# Altium schematic sheet Sheet1.SchDoc
size A; SheetNumber: 1; SheetTotal: 1
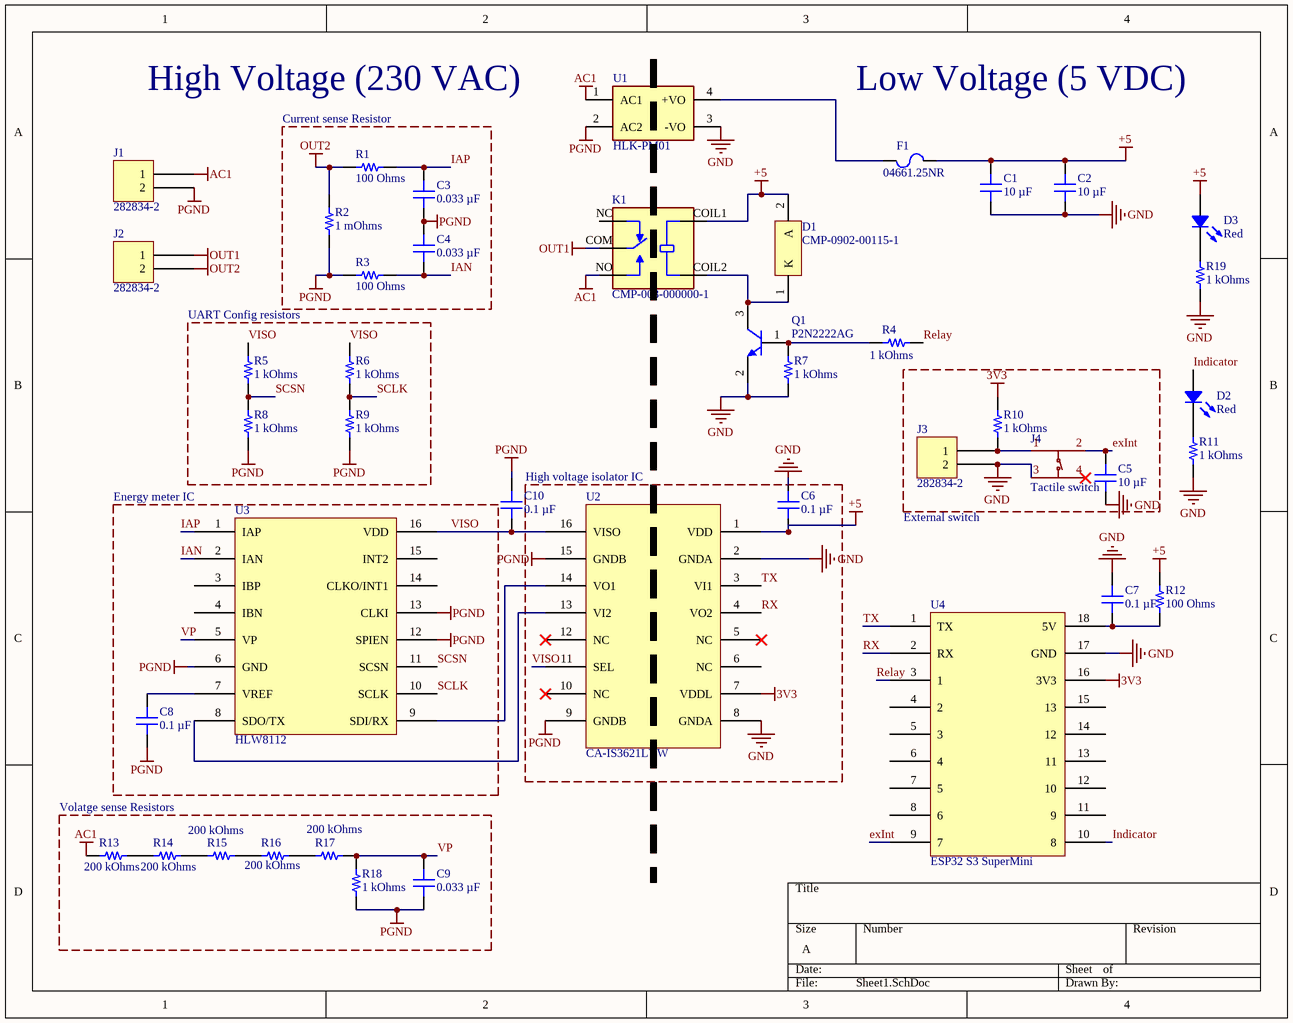
[diagram p0: Sheet1.SchDoc]

## Parts
C1  10 µF  [CAP 0805_2012]
C2  10 µF  [CAP 0805_2012]
C3  0.033 µF  [CAP 0805_2012]
C4  0.033 µF  [CAP 0805_2012]
C5  10 µF  [CAP 0805_2012]
C6  0.1 µF  [CAP 0805_2012]
C7  0.1 µF  [CAP 0805_2012]
C8  0.1 µF  [CAP 0805_2012]
C9  0.033 µF  [CAP 0805_2012]
C10  0.1 µF  [CAP 0805_2012]
D1  CMP-0902-00115-1  [CMP-0902-00115-1]
D2  Red  [LED 0805_2012 RED]
D3  Red  [LED 0805_2012 RED]
F1  04661.25NR  [FUSE 1206_3216 0.6MM]
J1  282834-2  [TE 282834-2]
J2  282834-2  [TE 282834-2]
J3  282834-2  [TE 282834-2]
J4  Tactile switch  [Tactive switch]
K1  CMP-003-000000-1  [CMP-003-000000-1]
Q1  P2N2222AG  [FP-SOT23-IPC_A]
R1  100 Ohms  [YAGEO RES 0805_2012]
R2  1 mOhms  [RES 1206_3216]
R3  100 Ohms  [YAGEO RES 0805_2012]
R4  1 kOhms  [RES 0805_2012]
R5  1 kOhms  [RES 0805_2012]
R6  1 kOhms  [RES 0805_2012]
R7  1 kOhms  [RES 0805_2012]
R8  1 kOhms  [RES 0805_2012]
R9  1 kOhms  [RES 0805_2012]
R10  1 kOhms  [RES 0805_2012]
R11  1 kOhms  [RES 0805_2012]
R12  100 Ohms  [YAGEO RES 0805_2012]
R13  200 kOhms  [RES 2512_6432]
R14  200 kOhms  [RES 2512_6432]
R15  200 kOhms  [RES 2512_6432]
R16  200 kOhms  [RES 2512_6432]
R17  200 kOhms  [RES 2512_6432]
R18  1 kOhms  [RES 0805_2012]
R19  1 kOhms  [RES 0805_2012]
U1  HLK-PM01  [HLK-PM01]
U2  CA-IS3621LVW  [CA-IS3621LVW]
U3  HLW8112  [HLW8112]
U4  ESP32 S3 SuperMini  [ESP32 S3 SuperMini]

## Blocks framed on the sheet
Current sense Resistor: C3 C4 R1-R3
UART Config resistors: R5 R6 R8 R9
Energy meter IC: C8 U3
High voltage isolator IC: C6 U2
Volatge sense Resistors: C9 R13-R18

## Nets
3V3: R10.1 U2.7(VDDL) U4.16(3V3)
+5: C1.1 C2.1 C6.1 D1.2(A) D3.1 F1.2 K1.COIL1 R12.2 U2.1(VDD)
AC1: J1.1 K1.NO R13.1 U1.1(AC1)
GND: C1.2 C2.2 C5.2 C6.2 C7.2 J3.2 J4.3(C) Q1.2(E) R7.1 R11.2 R19.2 U1.3(-VO) U2.2(GNDA) U2.8(GNDA) U4.17(GND)
OUT1: J2.1 K1.COM
OUT2: J2.2 R1.1 R2.2
PGND: C3.1 C4.2 C8.1 C9.1 C10.2 J1.2 R2.1 R3.1 R8.1 R9.1 R18.1 U1.2(AC2) U2.9(GNDB) U2.15(GNDB) U3.6(GND) U3.12(SPIEN) U3.13(CLKI)
exInt: C5.1 J4.2(B) U4.9(7)
IAN: C4.1 R3.2 U3.2(IAN)
IAP: C3.2 R1.2 U3.1(IAP)
Indicator: D2.1 U4.10(8)
Relay: R4.2 U4.3(1)
RX: U2.4(VO2) U4.2(RX)
SCLK: R6.1 R9.2 U3.10(SCLK)
SCSN: R5.1 R8.2 U3.11(SCSN)
TX: U2.3(VI1) U4.1(TX)
VISO: C10.1 R5.2 R6.2 U2.11(SEL) U2.16(VISO) U3.16(VDD)
VP: C9.2 R17.2 R18.2 U3.5(VP)
NetC7_1: C7.1 R12.1 U4.18(5V)
NetC8_2: C8.2 U3.7(VREF)
NetD1_1: D1.1(K) K1.COIL2 Q1.3(C)
NetD2_2: D2.2 R11.1
NetD3_2: D3.2 R19.1
NetF1_1: F1.1 U1.4(+VO)
NetJ3_1: J3.1 J4.1(A) R10.2
NetQ1_1: Q1.1(B) R4.1 R7.2
NetR13_2: R13.2 R14.1
NetR14_2: R14.2 R15.1
NetR15_2: R15.2 R16.1
NetR16_2: R16.2 R17.1
NetU2_13: U2.13(VI2) U3.8(SDO/TX)
NetU2_14: U2.14(VO1) U3.9(SDI/RX)

Not connected (* = marked no-connect by the designer): J4 4(D)*; K1 NC; U2 5(NC)* 6(NC) 10(NC)* 12(NC)*; U3 3(IBP) 4(IBN) 14(CLKO/INT1) 15(INT2); U4 4(2) 5(3) 6(4) 7(5) 8(6) 11(9) 12(10) 13(11) 14(12) 15(13)

## Notes on the sheet
- High Voltage (230 VAC)
- Low Voltage (5 VDC)
- External switch

## Library data of the parts
C1 C2 C5 = CL21Y106KPQVPNE: CAP CER 10UF 10V X7S 0805; manufacturer: Samsung Electro-Mechanics; Tolerance: ±10%; Part Number: CL21Y106KPQVPNE; Capacitance: 10 µF; Applications: Automotive; componentlink1description: Datasheet; componentlink1url: http://www.samsungsem.com/kr/support/product-search/mlcc/CL21Y106KPQVPNE.jsp; componentlink2description: DigiKey Link; componentlink2url: https://www.digikey.com/en/products/detail/samsung-electro-mechanics/CL21Y106KPQVPNE/5961169; Device Package: 0805 (2012 Metric); Features: General Purpose; lastupdated: 2026-04-06 7:33:17 PM; Lifecycle Status: Active; Minimum Order: 1; Mounting Type: Surface Mount, MLCC, Epoxy; Operating Temperature: -55°C ~ 125°C; Package / Case: 0805 (2012 Metric); packaging: TapeAndReel; partid: 2979; Part Status: Active; price: 0.06; Ratings: AEC-Q200; series: CL; Size / Dimension: 0.079" L x 0.049" W (2.00mm x 1.25mm); Supplier 1: DigiKey; Supplier Part Number 1: 1276-6685-1-ND; Temperature Coefficient: X7S; Thickness (Max): 0.055" (1.40mm); value: 10 µF; Voltage - Rated: 10V
C3 C4 C9 = C0805C333K5RECAUTO: CAP CER 0805 33NF 50V X7R 10%; manufacturer: KEMET; Part Number: C0805C333K5RECAUTO; Capacitance: 0.033 µF; Applications: Automotive, ESD Protection; componentlink1description: Datasheet; componentlink1url: https://api.kemet.com/component-edge/download/datasheet/C0805C333K5RECAUTO.pdf; componentlink2description: DigiKey Link; componentlink2url: https://www.digikey.com/en/products/detail/kemet/C0805C333K5RECAUTO/8646705; Device Package: 0805 (2012 Metric); lastupdated: 2026-04-06 7:32:00 PM; Lifecycle Status: Active; Minimum Order: 1; Mounting Type: Surface Mount, MLCC; Operating Temperature: -55°C ~ 125°C; Package / Case: 0805 (2012 Metric); packaging: TapeAndReel; partid: 32339; Part Status: Active; price: 0.04; Ratings: AEC-Q200; series: ESD SMD Auto X7R; Size / Dimension: 0.079" L x 0.049" W (2.00mm x 1.25mm); Supplier 1: DigiKey; Supplier Part Number 1: 399-C0805C333K5RECAUTOCT-ND; Temperature Coefficient: X7R; Thickness (Max): 0.043" (1.10mm); Tolerance: ±10%; value: 0.033 µF; Voltage - Rated: 50V
C6-C8 C10 = CC0805MRX7R9BB104: CAP CER 0.1UF 50V X7R 0805; manufacturer: Yageo; Tolerance: ±20%; Part Number: CC0805MRX7R9BB104; Capacitance: 0.1 µF; Applications: General Purpose; componentlink1description: Datasheet; componentlink1url: https://www.yageo.com/upload/media/product/productsearch/datasheet/mlcc/UPY-GPHC_X7R_6.3V-to-50V_18.pdf; componentlink2description: DigiKey Link; componentlink2url: https://www.digikey.com/en/products/detail/yageo/CC0805MRX7R9BB104/5884281; Device Package: 0805 (2012 Metric); lastupdated: 2026-04-06 7:33:19 PM; Lifecycle Status: Active; Minimum Order: 1; Mounting Type: Surface Mount, MLCC; Operating Temperature: -55°C ~ 125°C; Package / Case: 0805 (2012 Metric); packaging: TapeAndReel; partid: 2475; Part Status: Active; price: 0.01; series: CC; Size / Dimension: 0.079" L x 0.049" W (2.00mm x 1.25mm); Supplier 1: DigiKey; Supplier Part Number 1: 311-4351-1-ND; Temperature Coefficient: X7R; Thickness (Max): 0.037" (0.95mm); value: 0.1 µF; Voltage - Rated: 50V
D2 D3 = 5990110007F: LED RED 0805 SMD; Manufacturer: Dialight; Configuration: Standard; Current - Test: 20mA; Lens Color: 0.80mm; Lens Size: 1.40mm x 1.25mm; Lens Style: Rectangle with Flat Top; Millicandela Rating: 29mcd; Viewing Angle: 140°; Voltage - Forward (Vf) (Typ): 2.1V; Wavelength - Dominant: 633nm; Part Number: 5990110007F; Color: Red; ComponentLink1Description: Datasheet; ComponentLink1URL: http://www.dialightsignalsandcomponents.com/Assets/Brochures_And_Catalogs/Indication/CBI_SMD_new/Dialight_CBI_data_599-0805_Apr2018.pdf; ComponentLink2Description: DigiKey Link; ComponentLink2URL: https://www.digikey.com/en/products/detail/dialight/5990110007F/9385408; Device Package: 0805 (2012 Metric); Height (Max): 0.80mm; LastUpdated: 2026-04-05 8:38:27 PM; Lifecycle Status: Active; Minimum Order: 1; Mounting Type: Surface Mount; Package / Case: 0805 (2012 Metric); Packaging: TapeAndReel; PartId: 308; Part Status: Active; Price: 0.04; Series: 599; Size / Dimension: 2.00mm L x 1.25mm W; Supplier 1: DigiKey; Supplier Part Number 1: 350-4353-1-ND; Supplier Device Package: 0805; Value: Red
F1 = 04661.25NR: FUSE BOARD MOUNT 1.25A 63VAC/VDC; Manufacturer: Littelfuse Inc.; Approval Agency: CSA, UL; Breaking Capacity @ Rated Voltage: 50A; Fuse Type: Board Mount (Cartridge Style Excluded); Melting I²t: 0.064; Response Time: Fast Blow; Voltage Rating - AC: 63V; Part Number: 04661.25NR; Approvals: CSA, UL; ComponentLink1Description: Datasheet; ComponentLink1URL: https://www.littelfuse.com/~/media/electronics/datasheets/fuses/littelfuse_fuse_466_datasheet.pdf.pdf; ComponentLink2Description: DigiKey Link; ComponentLink2URL: http://digikey.com/product-detail/en/littelfuse-inc/04661.25NR/F1465CT-ND/521363; Current Rating (Amps): 1.25A; Device Package: 1206 (3216 Metric); LastUpdated: 2020-09-02 1:30:45 AM; Lifecycle Status: Active; Minimum Order: 1; Mounting Type: Surface Mount; Operating Temperature: -55°C ~ 90°C; Package / Case: 1206 (3216 Metric); Packaging: TapeAndReel; Part Status: Active; Price: 0.31; Series: SlimLine™ 466; Size / Dimension: 0.125" L x 0.060" W x 0.023" H (3.18mm x 1.52mm x 0.58mm); Supplier 1: DigiKey; Supplier Part Number 1: F1465CT-ND; Voltage Rating - DC: 63V
J1-J3 = 282834-2: TERM BLK 2P SIDE ENT 2.54MM PCB; Manufacturer: TE Connectivity AMP Connectors; Current: 10A; Mating Orientation: Horizontal with Board; Number of Levels: 1; Pitch: 0.100" (2.54mm); Positions Per Level: 2; Voltage: 150V; Wire Gauge: 16-30 AWG; Wire Termination: Screw - Rising Cage Clamp; Part Number: 282834-2; Color: Green; ComponentLink1Description: Datasheet; ComponentLink1URL: https://www.te.com/commerce/DocumentDelivery/DDEController?Action=srchrtrv&DocNm=282834&DocType=Customer+Drawing&DocLang=English; ComponentLink2Description: DigiKey Link; ComponentLink2URL: http://digikey.com/product-detail/en/te-connectivity-amp-connectors/282834-2/A98333-ND/1150135; LastUpdated: 2020-01-15 4:15:38 AM; Lifecycle Status: Active; Minimum Order: 1; Mounting Type: Through Hole; Packaging: Bulk; Part Status: Active; Price: 0.88; Series: Buchanan; Supplier 1: DigiKey; Supplier Part Number 1: A98333-ND
R1 R3 R12 = RC0805FR-07100RL: RES 100 OHM 1% 1/8W 0805; Manufacturer: Yageo; Power (Watts): 0.125W, 1/8W; Temperature Coefficient: ±100ppm/°C; Part Number: RC0805FR-07100RL; Value: 100 Ohms; ComponentLink1Description: Datasheet; ComponentLink1URL: https://www.yageo.com/upload/media/product/productsearch/datasheet/rchip/PYu-RC_Group_51_RoHS_L_10.pdf; ComponentLink2Description: DigiKey Link; ComponentLink2URL: https://www.digikey.com/en/products/detail/yageo/RC0805FR-07100RL/727543; Composition: Thick Film; Device Package: 0805 (2012 Metric); Features: Moisture Resistant; Height - Seated (Max): 0.024" (0.60mm); LastUpdated: 2026-04-05 9:17:59 PM; Lifecycle Status: Active; Minimum Order: 1; Number of Terminations: 2; Operating Temperature: -55°C ~ 155°C; Package / Case: 0805 (2012 Metric); Packaging: TapeAndReel; PartId: 47644; Part Status: Active; Price: 0.01; Resistance: 100 Ohms; Series: RC_L; Size / Dimension: 0.079" L x 0.049" W (2.00mm x 1.25mm); Supplier 1: DigiKey; Supplier Part Number 1: 311-100CRCT-ND; Supplier Device Package: 0805; Tolerance: ±1%
R2 = CRK0612-FZ-R001E: RES 0.001 OHM 1% 1W 1206; Manufacturer: Bourns Inc.; Temperature Coefficient: ±50ppm/°C; Part Number: CRK0612-FZ-R001E; ComponentLink1Description: Datasheet; ComponentLink1URL: https://www.bourns.com/docs/Product-Datasheets/CRK.pdf; ComponentLink2Description: DigiKey Link; ComponentLink2URL: https://www.digikey.com/en/products/detail/bourns-inc/CRK0612-FZ-R001E/10064045; Composition: Metal Element; Device Package: 1206 (3216 Metric); Features: Current Sense, Moisture Resistant; Height - Seated (Max): 0.031" (0.80mm); LastUpdated: 2026-04-06 7:59:55 PM; Lifecycle Status: Active; Minimum Order: 1; Number of Terminations: 2; Operating Temperature: -55°C ~ 170°C; Package / Case: 1206 (3216 Metric); Packaging: TapeAndReel; PartId: 66263; Part Status: Active; Power (Watts): 1W; Price: 0.15; Resistance: 1 mOhms; Series: CRK; Size / Dimension: 0.067" L x 0.126" W (1.70mm x 3.20mm); Supplier 1: DigiKey; Supplier Part Number 1: CRK0612-FZ-R001ECT-ND; Supplier Device Package: 0612; Tolerance: ±1%; Value: 1 mOhms; LCSC PRT #: C7467246
R4-R11 R18 R19 = 1-2176092-8: RES SMD 1K OHM 0.1% 1/4W 0805; Manufacturer: TE Connectivity Passive Product; Power (Watts): 0.25W, 1/4W; Temperature Coefficient: ±25ppm/°C; Part Number: 1-2176092-8; Value: 1 kOhms; ComponentLink1Description: Datasheet; ComponentLink1URL: https://www.te.com/commerce/DocumentDelivery/DDEController?Action=srchrtrv&DocNm=1773272&DocType=DS&DocLang=English; ComponentLink2Description: DigiKey Link; ComponentLink2URL: https://www.digikey.com/en/products/detail/te-connectivity-passive-product/1-2176092-8/4034011; Composition: Thin Film; Device Package: 0805 (2012 Metric); Height - Seated (Max): 0.026" (0.65mm); LastUpdated: 2026-04-05 8:11:23 PM; Lifecycle Status: Active; Minimum Order: 1; Number of Terminations: 2; Operating Temperature: -55°C ~ 155°C; Package / Case: 0805 (2012 Metric); Packaging: TapeAndReel; PartId: 28484; Part Status: Active; Price: 0.13; Resistance: 1 kOhms; Series: RP73P, Holsworthy; Size / Dimension: 0.079" L x 0.049" W (2.00mm x 1.25mm); Supplier 1: DigiKey; Supplier Part Number 1: A110543CT-ND; Supplier Device Package: 0805; Tolerance: ±0.1%
R13-R17 = RMCF2512FT200K: RES 200K OHM 1% 1W 2512; manufacturer: Stackpole Electronics Inc; Temperature Coefficient: ±100ppm/°C; Part Number: RMCF2512FT200K; componentlink1description: Datasheet; componentlink1url: https://www.seielect.com/catalog/sei-rmcf_rmcp.pdf; componentlink2description: DigiKey Link; componentlink2url: http://digikey.com/product-detail/en/stackpole-electronics-inc/RMCF2512FT200K/RMCF2512FT200KCT-ND/6053387; Composition: Thick Film; Device Package: 2512 (6432 Metric); Features: Automotive AEC-Q200; Height - Seated (Max): 0.028" (0.70mm); lastupdated: 2020-09-02 1:26:51 AM; Lifecycle Status: Active; Minimum Order: 1; Number of Terminations: 2; Operating Temperature: -55°C ~ 155°C; Package / Case: 2512 (6432 Metric); packaging: TapeAndReel; Part Status: Active; Power (Watts): 1W; price: 0.04; Ratings: AEC-Q200; Resistance: 200 kOhms; series: RMCF; Size / Dimension: 0.248" L x 0.126" W (6.30mm x 3.20mm); Supplier 1: DigiKey; Supplier Part Number 1: RMCF2512FT200KCT-ND; Supplier Device Package: 2512; Tolerance: ±1%; value: 200 kOhms; LCSC PRT #: C2934059
U2 = CA-IS3621LVW: LCSC PRT #: C20598866
U3 = HLW8112: LCSC PRT #: C970140